# EAGLE schematic Companion_Board (EAGLE 7.5.0)
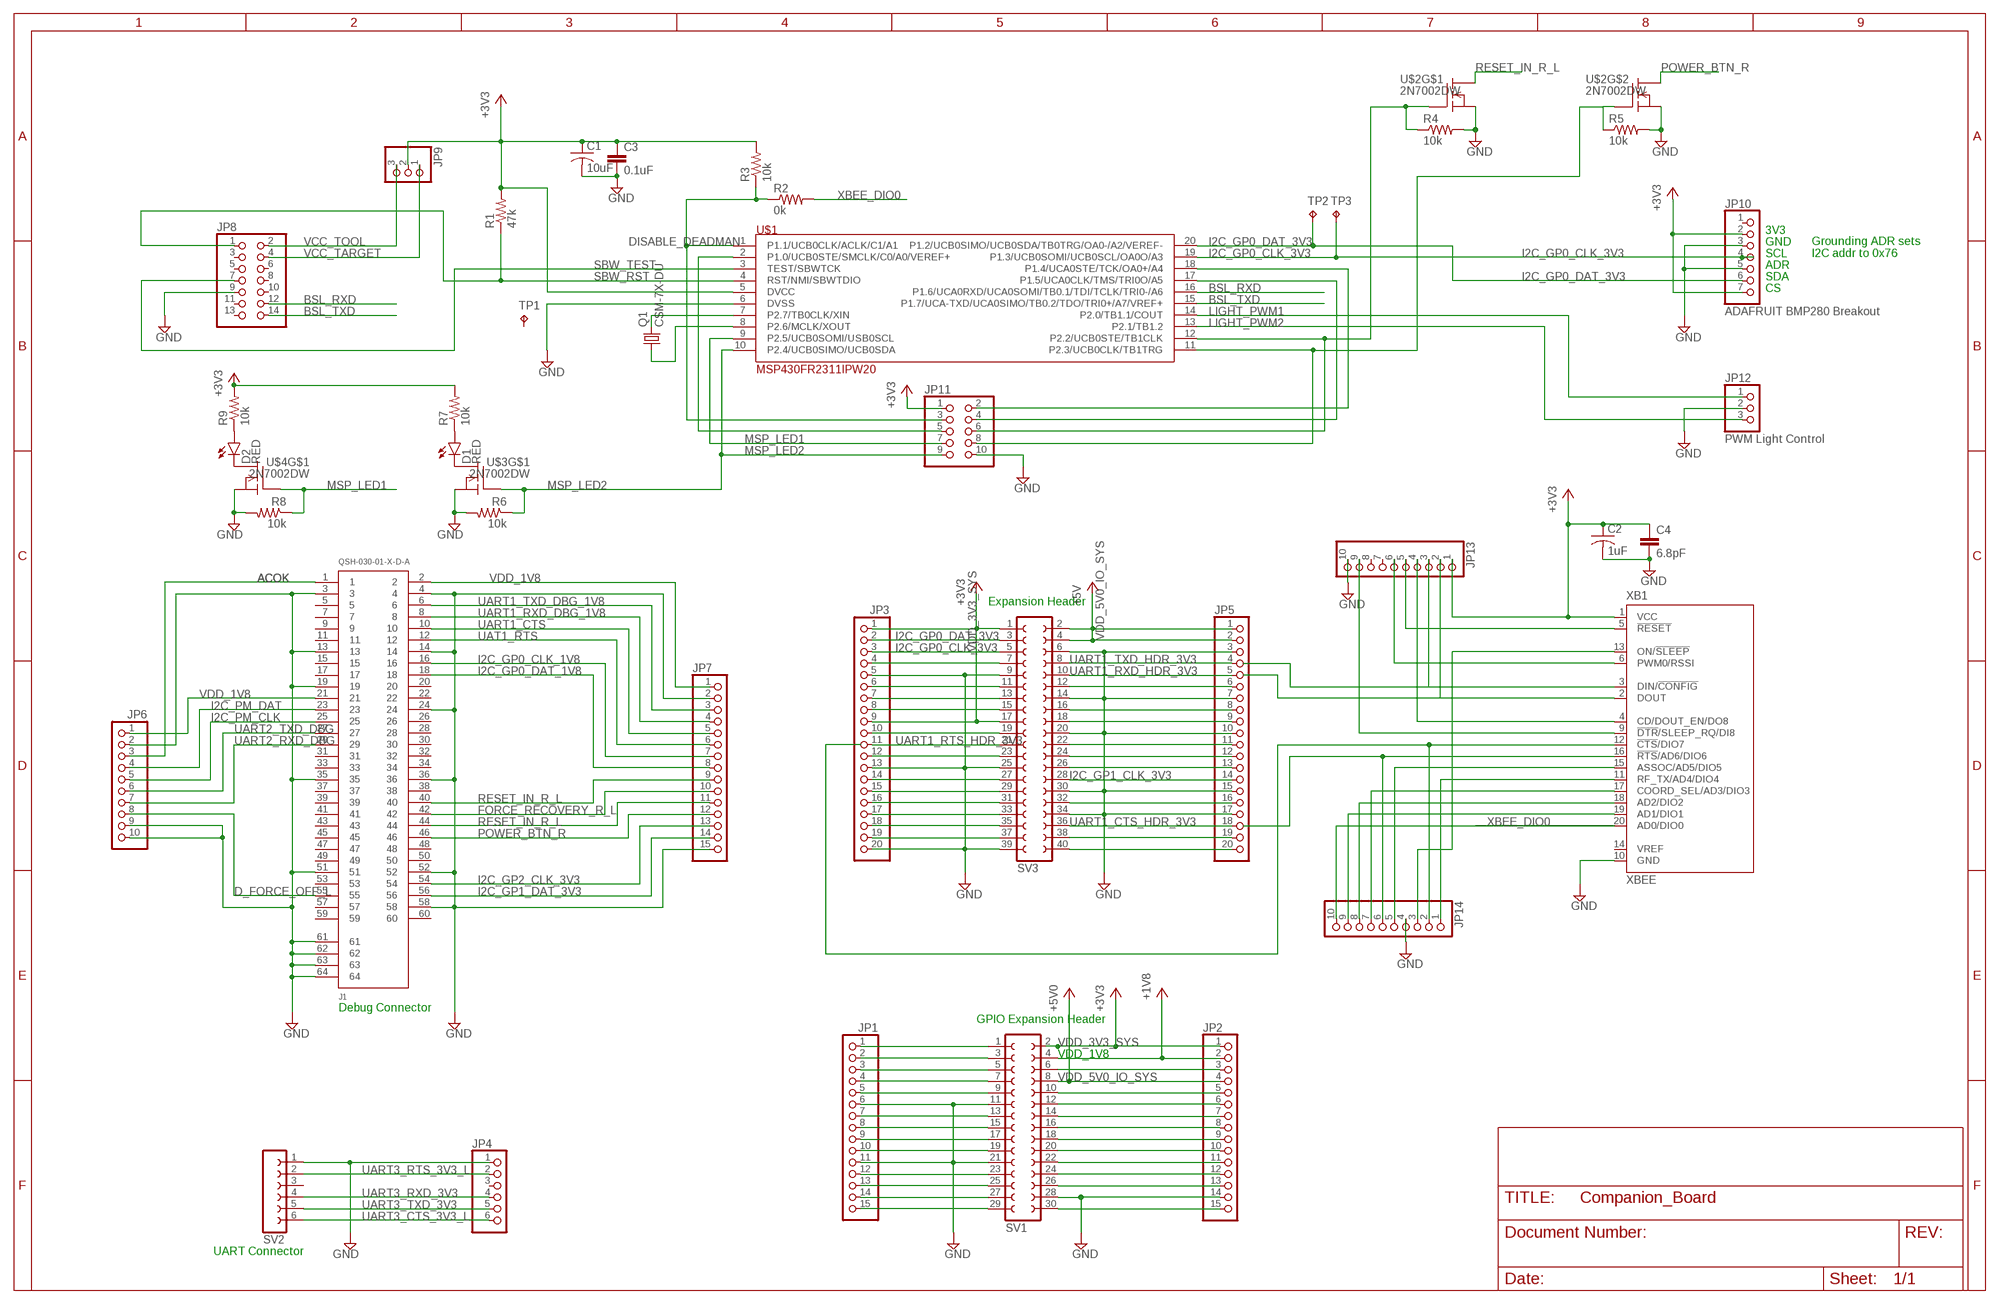
[diagram p0: schematic, sheet 1]

## Parts
C1  10uF  C-USC1206  [C1206]
C2  1uF  C-USC1206  [C1206]
C3  0.1uF  C-EUC0805  [C0805]
C4  6.8pF  C-EUC0805  [C0805]
D1  RED  LED-RED1206  [LED-1206]
D2  RED  LED-RED1206  [LED-1206]
J1  QSH-030-01-X-D-A  [QSH-030-01-X-D-A]
JP1  PINHD-1X15  [1X15]
JP2  PINHD-1X15  [1X15]
JP3  PINHD-1X20  [1X20]
JP4  PINHD-1X6  [1X06]
JP5  PINHD-1X20  [1X20]
JP6  PINHD-1X10  [1X10]
JP7  PINHD-1X15  [1X15]
JP8  PINHD-2X7  [2X07]
JP9  PINHD-1X3  [1X03]
JP10  ADAFRUIT BMP280 Breakout  PINHD-1X7  [1X07]
JP11  PINHD-2X5  [2X05]
JP12  PWM Light Control  PINHD-1X3/90  [1X03/90]
JP13  PINHD-1X10  [1X10]
JP14  PINHD-1X10  [1X10]
Q1  CSM-7X-DU  [CSM-7X-DU]
R1  47k  R-US_R0805  [R0805]
R2  0k  R-US_R0805  [R0805]
R3  10k  R-US_R0805  [R0805]
R4  10k  R-US_R0805  [R0805]
R5  10k  R-US_R0805  [R0805]
R6  10k  R-US_R0805  [R0805]
R7  10k  R-US_R0805  [R0805]
R8  10k  R-US_R0805  [R0805]
R9  10k  R-US_R0805  [R0805]
SV1  FE15-2  [FE15-2]
SV2  FE06-1  [FE06]
SV3  FE20-2  [FE20-2]
TP1  TPPAD1-13  [P1-13]
TP2  TPPAD1-13  [P1-13]
TP3  TPPAD1-13  [P1-13]
U$1  MSP430FR2311IPW20  [SOP65P640X120-20N]
U$2  2N7002DW  [SOT363]
U$3  2N7002DW  [SOT363]
U$4  2N7002DW  [SOT363]
XB1  XBEE  [XBEE]

## Nets
+3V3: C1.1 C2.1 C3.1 C4.1 JP2.1 JP9.2 JP10.2 JP10.7 JP11.1 JP13.1 R1.2 R3.2 R7.2 R9.2 SV1.2 U$1.5(DVCC) XB1.1(VCC)
+5V: JP2.4 SV1.8 ; supply symbol labelled +5V0
ACOK: J1.1 JP6.3
BSL_RXD: JP8.12 U$1.16(P1.6/UCA0RXD/UCA0SOMI/TB0.1/TDI/TCLK/TRI0-/A6)
BSL_TXD: JP8.14 U$1.15(P1.7/UCA-TXD/UCA0SIMO/TB0.2/TDO/TRI0+/A7/VREF+)
D_FORCE_OFF_L: J1.55 JP6.8
DISABLE_DEADMAN: JP11.3 R2.1 R3.1 U$1.1(P1.1/UCB0CLK/ACLK/C1/A1)
FORCE_RECOVERY_R_L: J1.42 JP7.10
GND: C1.2 C2.2 C3.2 C4.2 J1.3 J1.4 J1.13 J1.14 J1.19 J1.24 J1.35 J1.36 J1.51 J1.52 J1.58 J1.61 J1.62 J1.63 J1.64 JP1.6 JP1.11 JP2.14 JP3.5 JP3.13 JP3.20 JP4.1 JP5.3 JP5.7 JP5.10 JP5.15 JP5.17 JP6.2 JP6.9 JP6.10 JP7.2 JP7.15 JP8.9 JP10.3 JP10.5 JP11.10 JP12.2 JP13.10 JP14.4 R4.2 R5.2 R6.2 R8.2 SV1.11 SV1.21 SV1.28 SV2.1 SV3.6 SV3.9 SV3.14 SV3.20 SV3.25 SV3.30 SV3.34 SV3.39 U$1.6(DVSS) U$2.1(S) U$2.4(S) U$3.1(S) U$4.1(S) XB1.10(GND)
I2C_GP0_CLK_1V8: J1.16 JP7.7
I2C_GP0_CLK_3V3: JP3.3 JP10.4 SV3.5 TP3.TP U$1.19(P1.3/UCB0SOMI/UCB0SCL/OA0O/A3)
I2C_GP0_DAT_1V8: J1.18 JP7.8
I2C_GP0_DAT_3V3: JP3.2 JP10.6 SV3.3 TP2.TP U$1.20(P1.2/UCB0SIMO/UCB0SDA/TB0TRG/OA0-/A2/VEREF-)
I2C_GP1_CLK_3V3: JP5.14 SV3.28
I2C_GP1_DAT_3V3: J1.56 JP7.14
I2C_GP2_CLK_3V3: J1.54 JP7.13
I2C_PM_CLK: J1.25 JP6.5
I2C_PM_DAT: J1.23 JP6.4
LIGHT_PWM1: JP12.1 U$1.14(P2.0/TB1.1/COUT)
LIGHT_PWM2: JP12.3 U$1.13(P2.1/TB1.2)
MSP_LED1: JP11.7 R8.1 U$1.9(P2.5/UCB0SOMI/USB0SCL) U$4.2(G)
MSP_LED2: JP11.9 R6.1 U$1.10(P2.4/UCB0SIMO/UCB0SDA) U$3.2(G)
N$1: JP1.1 SV1.1
N$2: JP1.2 SV1.3
N$3: JP1.3 SV1.5
N$4: JP1.4 SV1.7
N$5: JP1.5 SV1.9
N$6: JP13.2 XB1.2(DOUT)
N$7: JP1.7 SV1.13
N$8: JP1.8 SV1.15
N$9: JP1.9 SV1.17
N$10: JP1.10 SV1.19
N$11: JP13.3 XB1.3(DIN/!CONFIG)
N$12: JP1.12 SV1.23
N$13: JP1.13 SV1.25
N$14: JP1.14 SV1.27
N$15: JP1.15 SV1.29
N$16: JP2.15 SV1.30
N$17: JP2.13 SV1.26
N$18: JP2.12 SV1.24
N$19: JP2.11 SV1.22
N$20: JP2.10 SV1.20
N$21: JP2.9 SV1.18
N$22: JP2.8 SV1.16
N$23: JP2.7 SV1.14
N$24: JP2.6 SV1.12
N$25: JP2.5 SV1.10
N$26: JP3.4 SV3.7
N$27: JP2.3 SV1.6
N$28: JP3.6 SV3.11
N$29: JP3.7 SV3.13
N$30: JP3.8 SV3.15
N$31: JP3.10 SV3.19
N$32: JP14.6 XB1.16(!RTS!/AD6/DIO6)
N$33: JP3.12 SV3.23
N$34: JP3.14 SV3.27
N$35: JP3.15 SV3.29
N$36: JP3.16 SV3.31
N$37: JP3.17 SV3.33
N$38: JP3.18 SV3.35
N$39: JP3.19 SV3.37
N$40: JP14.2 XB1.12(!CTS!/DIO7)
N$41: Q1.2 U$1.7(P2.7/TB0CLK/XIN)
N$42: JP5.6 SV3.12
N$43: JP5.8 SV3.16
N$44: JP5.9 SV3.18
N$45: JP5.11 SV3.22
N$46: JP5.12 SV3.24
N$47: Q1.1 U$1.8(P2.6/MCLK/XOUT)
N$48: JP11.5 U$1.2(P1.0/UCB0STE/SMCLK/C0/A0/VEREF+)
N$49: JP5.16 SV3.32
N$51: JP5.19 SV3.38
N$52: JP5.20 SV3.40
N$54: JP11.2 U$1.18(P1.4/UCA0STE/TCK/OA0+/A4)
N$55: JP11.4 U$1.17(P1.5/UCA0CLK/TMS/TRI0O/A5)
N$56: JP11.6 R4.1 U$1.12(P2.2/UCB0STE/TB1CLK) U$2.2(G)
N$57: JP11.8 R5.1 U$1.11(P2.3/UCB0CLK/TB1TRG) U$2.5(G)
N$59: JP13.5 XB1.5(!RESET)
N$60: JP13.6 XB1.6(PWM0/RSSI)
N$61: JP13.4 XB1.4(CD/DOUT_EN/DO8)
N$62: JP13.9 XB1.9(!DTR!/SLEEP_RQ/DI8)
N$63: JP14.3 XB1.13(ON/!SLEEP)
N$64: JP14.5 XB1.15(ASSOC/AD5/DIO5)
N$65: JP14.1 XB1.11(RF_TX/AD4/DIO4)
N$66: JP14.7 XB1.17(COORD_SEL/AD3/DIO3)
N$67: JP14.8 XB1.18(AD2/DIO2)
N$68: JP14.9 XB1.19(AD1/DIO1)
N$69: D1.C U$3.6(D)
N$70: D1.A R7.1
N$72: D2.C U$4.6(D)
N$73: D2.A R9.1
POWER_BTN_R: J1.46 JP7.12 U$2.3(D)
RESET_IN_R_L: J1.40 J1.44 JP7.9 JP7.11 U$2.6(D)
SBW_RST: JP8.1 R1.1 U$1.4(RST/NMI/SBWTDIO)
SBW_TEST: JP8.7 U$1.3(TEST/SBWTCK)
SPI_CS1_3V3: JP5.13 SV3.26
UART1_CTS: J1.10 JP7.5
UART1_CTS_HDR_3V3: JP5.18 SV3.36
UART1_RTS_HDR_3V3: JP3.11 SV3.21
UART1_RXD_DBG_1V8: J1.8 JP7.4
UART1_RXD_HDR_3V3: JP5.5 SV3.10
UART1_TXD_DBG_1V8: J1.6 JP7.3
UART1_TXD_HDR_3V3: JP5.4 SV3.8
UART2_RXD_DBG: J1.29 JP6.7
UART2_TXD_DBG: J1.27 JP6.6
UART3_CTS_3V3_L: JP4.6 SV2.6
UART3_RTS_3V3_L: JP4.2 SV2.2
UART3_RXD_3V3: JP4.4 SV2.4
UART3_TXD_3V3: JP4.5 SV2.5
UAT1_RTS: J1.12 JP7.6
VCC_TARGET: JP8.4 JP9.1
VCC_TOOL: JP8.2 JP9.3
VDD_1V8: J1.2 J1.21 JP2.2 JP6.1 JP7.1 SV1.4 ; supply symbol labelled +1V8
VDD_3V3_SYS: JP3.1 JP3.9 SV3.1 SV3.17 ; supply symbol labelled +3V3
VDD_5V0_IO_SYS: JP5.1 JP5.2 SV3.2 SV3.4 ; supply symbol labelled +5V
XBEE_DIO0: JP14.10 R2.2 XB1.20(AD0/DIO0)
Unconnected: J1.5 J1.7 J1.9 J1.11 J1.15 J1.17 J1.20 J1.22 J1.26 J1.28 J1.30 J1.31 J1.32 J1.33 J1.34 J1.37 J1.38 J1.39 J1.41 J1.43 J1.45 J1.47 J1.48 J1.49 J1.50 J1.53 J1.57 J1.59 J1.60 JP4.3 JP8.3 JP8.5 JP8.6 JP8.8 JP8.10 JP8.11 JP8.13 JP10.1 JP13.7 JP13.8 SV2.3 TP1.TP U$3.3(D) U$3.4(S) U$3.5(G) U$4.3(D) U$4.4(S) U$4.5(G) XB1.14(VREF)

## Notes on the sheet
- 3V3
- GND
- SCL
- Grounding ADR sets 
  I2C addr to 0x76
- ADR
- SDA
- CS
- Expansion Header
- Debug Connector
- GPIO Expansion Header
- UART Connector

## Library data of the parts
C1 C2 = resistor:C-US: CAPACITOR, American symbol
C3 C4 = resistor:C-EU: CAPACITOR, European symbol
D1 D2 = SparkFun-LED:LED-RED: Assorted Red LEDs LilyPad 1206- DIO-09912 1206- DIO-00809 0603- DIO-00819 "SMART" means more efficient and expensive; PROD_ID: DIO-09912
J1 = QSH-030-01-X-D-A:QSH-030-01-X-D-A: HIGH SPEED SOCKET STRIP, .5mm PITCH, 60 PINS. MANUFACTURER:SAMTEC.
JP1 JP2 JP7 = pinhead:PINHD-1X15: PIN HEADER
JP3 JP5 = pinhead:PINHD-1X20: PIN HEADER
JP4 = pinhead:PINHD-1X6: PIN HEADER
JP6 JP13 JP14 = pinhead:PINHD-1X10: PIN HEADER
JP8 = pinhead:PINHD-2X7: PIN HEADER
JP9 JP12 = pinhead:PINHD-1X3: PIN HEADER
JP10 = pinhead:PINHD-1X7: PIN HEADER
JP11 = pinhead:PINHD-2X5: PIN HEADER
Q1 = crystal:CSM-7X-DU: SMD CRYSTAL Source: www.ecsxtal.com .. Crystal 3.6864MHz CSM_7X_DU.PDF; OC_FARNELL: unknown; OC_NEWARK: unknown
R1-R9 = resistor:R-US_: RESISTOR, American symbol
SV1 = con-lsta:FE15-2: FEMALE HEADER; OC_FARNELL: unknown; OC_NEWARK: unknown
SV2 = con-lsta:FE06-1: FEMALE HEADER; OC_FARNELL: unknown; OC_NEWARK: unknown
SV3 = con-lsta:FE20-2: FEMALE HEADER; OC_FARNELL: unknown; OC_NEWARK: unknown
TP1-TP3 = testpad:TP: Test pad
U$1 = companion_board:MSP430FR2311IPW20
U$2-U$4 = companion_board:2N7002DW
XB1 = maxstream:XBEE: XBee (TM) /XBee-PRO(TM) OEM RF Modules Source: MaxStream, Inc. xbee_productmanual.pdf; MPN: XBP24-Z7UIT-004; OC_FARNELL: 1751799; OC_NEWARK: 34R5507